# Altium schematic sheet MCU-and-ICs.schdoc
size A4; SheetNumber: 5; SheetTotal: 5
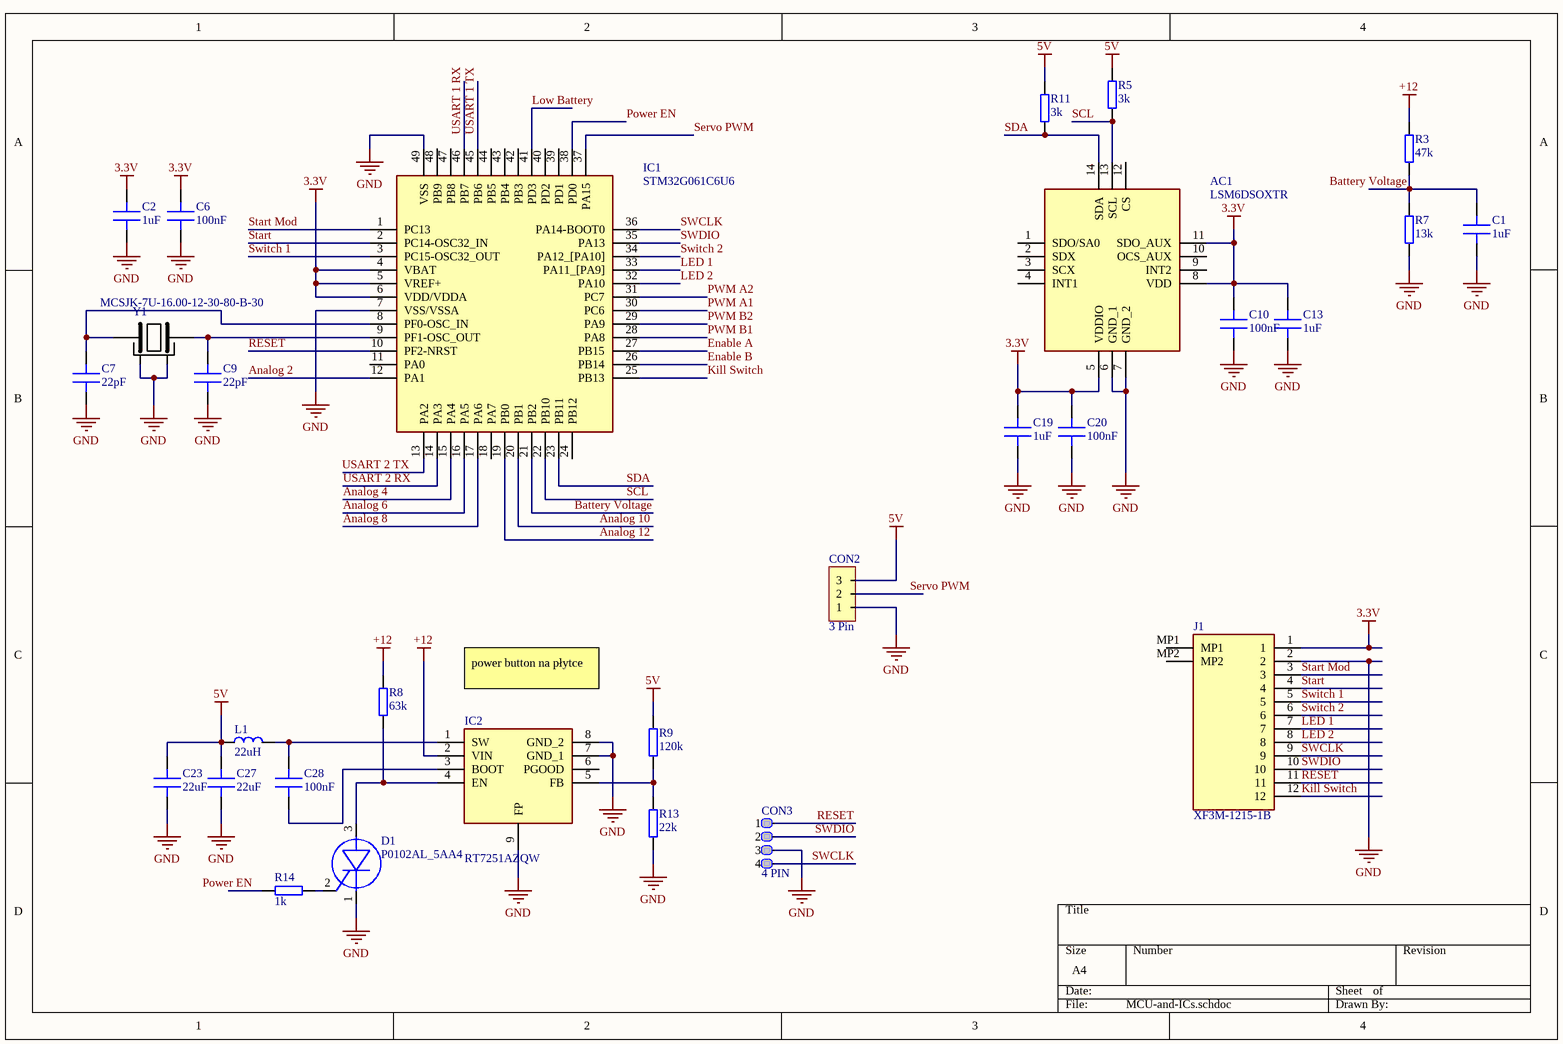
[diagram p0: MCU-and-ICs.schdoc]

## Parts
AC1  LSM6DSOXTR  [LGA-14_1]
C1  1uF  [C 0402]
C2  1uF  [C 0402]
C6  100nF  [C 0402]
C7  22pF  [C 0402]
C9  22pF  [C 0402]
C10  100nF  [C 0402]
C13  1uF  [C 0402]
C19  1uF  [C 0402]
C20  100nF  [C 0402]
C23  22uF  [C 0805]
C27  22uF  [C 0805]
C28  100nF  [C 0402]
CON2  3 Pin  [BM03B-SRSS-TB]
CON3  4 PIN  [SM04B-SRSS-TB]
D1  P0102AL_5AA4  [SOT95P255X140-3N]
IC1  STM32G061C6U6  [QFN50P700X700X65-49N-D]
IC2  RT7251AZQW  [SON50P200X200X80-9N-D]
J1  XF3M-1215-1B  [XF3M12151B]
L1  22uH  [HPI0630]
R3  47k  [R 0402]
R5  3k  [R 0402]
R7  13k  [R 0402]
R8  63k  [R 0402]
R9  120k  [R 0402]
R11  3k  [R 0402]
R13  22k  [R 0402]
R14  1k  [R 0402]
Y1  MCSJK-7U-16.00-12-30-80-B-30  [MCSJK7U1600123080B30]

## Nets
3.3V: AC1.5(VDDIO) AC1.8(VDD) AC1.11(SDO_AUX) C2.1 C6.1 C10.1 C13.1 C19.1 C20.1 IC1.4(VBAT) IC1.5(VREF+) IC1.6(VDD/VDDA) J1.1
5V: C23.1 C27.1 CON2.3 L1.1 R5.2 R9.2 R11.2
+12: IC2.2(VIN) R3.2 R8.2
GND: AC1.6(GND_1) AC1.7(GND_2) C1.2 C2.2 C6.2 C7.2 C9.2 C10.2 C13.2 C19.2 C20.2 C23.2 C27.2 CON2.1 CON3.3 D1.1(K) IC1.7(VSS/VSSA) IC1.49(VSS) IC2.7(GND_1) IC2.8(GND_2) IC2.9(FP) J1.2 R7.1 R13.1 Y1.2(GND_1) Y1.4(GND_2)
Analog 2: IC1.12(PA1)
Analog 4: IC1.15(PA4)
Analog 6: IC1.16(PA5)
Analog 8: IC1.17(PA6)
Analog 10: IC1.20(PB1)
Analog 12: IC1.19(PB0)
Battery Voltage: C1.1 IC1.21(PB2) R3.1 R7.2
Enable A: IC1.27(PB15)
Enable B: IC1.26(PB14)
Kill Switch: IC1.25(PB13) J1.12
LED 1: IC1.33(PA11_[PA9]) J1.7
LED 2: IC1.32(PA10) J1.8
Low Battery: IC1.41(PD3)
Power EN: IC1.38(PD0) R14.2
PWM A1: IC1.30(PC6)
PWM A2: IC1.31(PC7)
PWM B1: IC1.28(PA8)
PWM B2: IC1.29(PA9)
RESET: CON3.1 IC1.10(PF2-NRST) J1.11
SCL: AC1.13(SCL) IC1.22(PB10) R5.1
SDA: AC1.14(SDA) IC1.23(PB11) R11.1
Servo PWM: CON2.2 IC1.37(PA15)
Start: IC1.2(PC14-OSC32_IN) J1.4
Start Mod: IC1.1(PC13) J1.3
SWCLK: CON3.4 IC1.36(PA14-BOOT0) J1.9
SWDIO: CON3.2 IC1.35(PA13) J1.10
Switch 1: IC1.3(PC15-OSC32_OUT) J1.5
Switch 2: IC1.34(PA12_[PA10]) J1.6
USART 1 RX: IC1.46(PB7)
USART 1 TX: IC1.45(PB6)
USART 2 RX: IC1.14(PA3)
USART 2 TX: IC1.13(PA2)
NetC7_1: C7.1 IC1.8(PF0-OSC_IN) Y1.1(CRYSTAL_1)
NetC9_1: C9.1 IC1.9(PF1-OSC_OUT) Y1.3(CRYSTAL_2)
NetC28_1: C28.1 IC2.1(SW) L1.2
NetC28_2: C28.2 IC2.3(BOOT)
NetD1_2: D1.2(G) R14.1
NetD1_3: D1.3(A) IC2.4(EN) R8.1
NetIC2_5: IC2.5(FB) R9.1 R13.2

Not connected (* = marked no-connect by the designer): AC1 1(SDO/SA0) 2(SDX) 3(SCX) 4(INT1) 9(INT2) 10(OCS_AUX) 12(CS); IC1 11(PA0) 18(PA7) 24(PB12) 39(PD1) 40(PD2) 42(PB3) 43(PB4) 44(PB5) 47(PB8) 48(PB9); IC2 6(PGOOD); J1 MP1 MP2

## Notes on the sheet
- power button na płytce

## Library data of the parts
AC1 = LSM6DSOXTR: Accelerometer; Manufacturer_Name: STMicroelectronics; Datasheet Link: https://www.st.com/resource/en/datasheet/lsm6dsox.pdf; Manufacturer_Part_Number: LSM6DSOXTR; Mouser Part Number: 511-LSM6DSOXTR; Mouser Price/Stock: https://www.mouser.co.uk/ProductDetail/STMicroelectronics/LSM6DSOXTR?qs=l7cgNqFNU1i9dcjzItLpVQ%3D%3D; Arrow Part Number: LSM6DSOXTR; Arrow Price/Stock: https://www.arrow.com/en/products/lsm6dsoxtr/stmicroelectronics
C1 C2 C6 C7 C9 C10 C13 C19 C20 C23 C27 C28 = Capacitor: MLCC Capacitor
D1 = P0102AL_5AA4: SCR; Manufacturer_Name: STMicroelectronics; Manufacturer_Part_Number: P0102AL 5AA4; Datasheet Link: https://www.st.com/resource/en/datasheet/p0102al.pdf; Height: 1.4mm; Mouser Part Number: 511-P0102AL; Mouser Price/Stock: https://www.mouser.co.uk/ProductDetail/STMicroelectronics/P0102AL-5AA4/?qs=PjVWedEN3CRKQvFRu1Tr6Q%3D%3D; Arrow Part Number: P0102AL 5AA4; Arrow Price/Stock: https://www.arrow.com/en/products/p0102al5aa4/stmicroelectronics
IC1 = STM32G061C6U6: Integrated Circuit; Manufacturer_Name: STMicroelectronics; Datasheet Link: https://www.st.com/resource/en/datasheet/stm32g061c6.pdf; Height: 0.65mm; Manufacturer_Part_Number: STM32G061C6U6; Mouser Part Number: 511-STM32G061C6U6; Mouser Price/Stock: https://www.mouser.co.uk/ProductDetail/STMicroelectronics/STM32G061C6U6?qs=CiayqK2gdcKUDq0OUzUqqg%3D%3D
IC2 = RT7251AZQW: Integrated Circuit; Manufacturer_Name: RICHTEK; Datasheet Link: https://componentsearchengine.com/Datasheets/2/RT7251AZQW.pdf; Height: 0.8mm; Manufacturer_Part_Number: RT7251AZQW
J1 = XF3M-1215-1B: Connector; Manufacturer_Name: Omron Electronics; Datasheet Link: https://datasheet.lcsc.com/szlcsc/Omron-Electronics-XF3M-1215-1B_C231431.pdf; Height: 2mm; Manufacturer_Part_Number: XF3M-1215-1B; Mouser Part Number: 653-XF3M-1215-1B; Mouser Price/Stock: https://www.mouser.co.uk/ProductDetail/Omron-Electronics/XF3M-1215-1B?qs=1He0yLMpldAQYeSJcjbchQ%3D%3D; Arrow Part Number: XF3M-1215-1B; Arrow Price/Stock: https://www.arrow.com/en/products/xf3m-1215-1b/omron
L1 = Inductor: General pourpouse inductor
R3 R5 R7-R9 R11 R13 R14 = Resistor: General pourpouse resistor
Y1 = MCSJK-7U-16.00-12-30-80-B-30: Crystal or Oscillator; Manufacturer_Name: MULTICOMP; Datasheet Link: https://www.farnell.com/datasheets/2864166.pdf; Height: 0.8mm; Manufacturer_Part_Number: MCSJK-7U-16.00-12-30-80-B-30